# Altium schematic sheet Power.SchDoc
size B; SheetNumber: 1; SheetTotal: 4
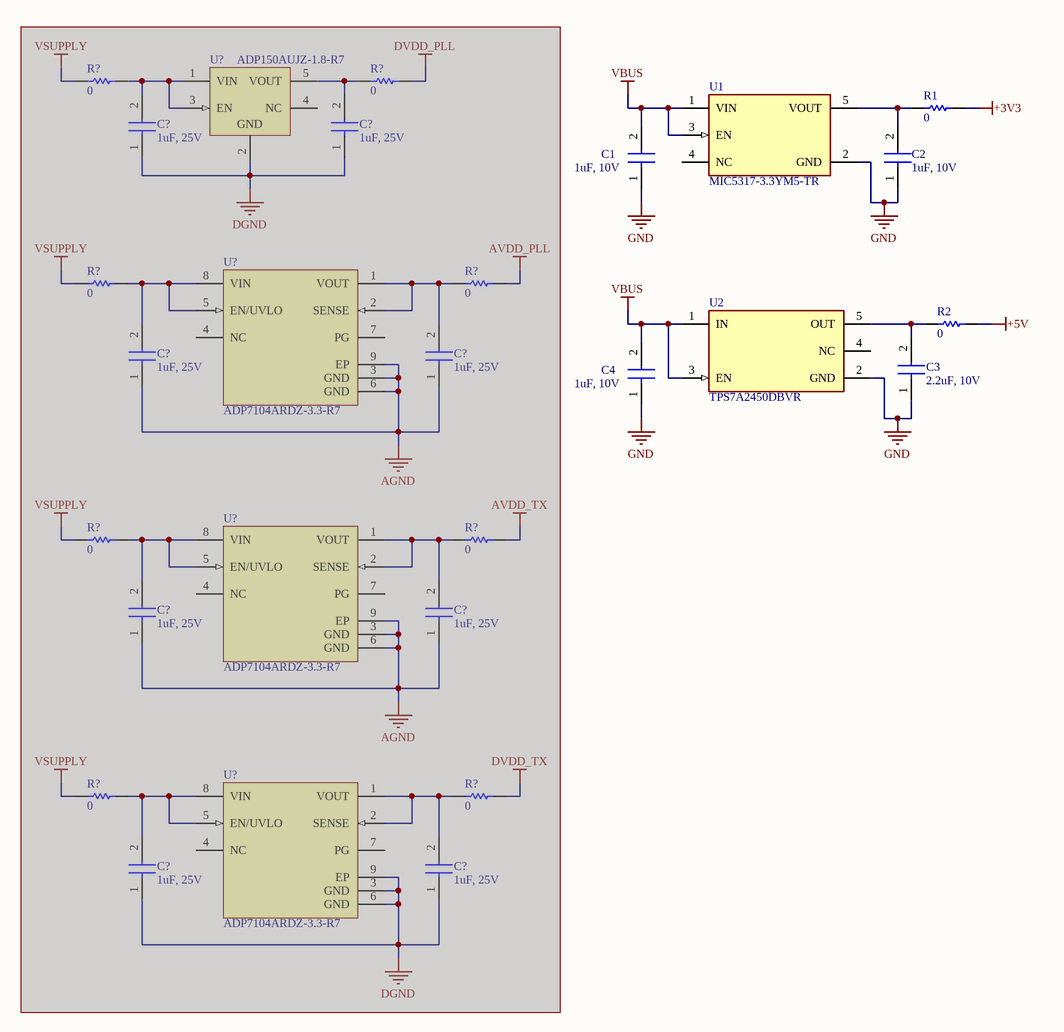
[diagram p0: Power.SchDoc]

## Parts
(Parts that share a designator on the sheet are numbered #1, #2 ... from top to bottom, then left to right.)
C1  1uF, 10V  [FP-CL10-IPC_A]
C2  1uF, 10V  [FP-CL10-IPC_A]
C3  2.2uF, 10V  [FP-CL10-IPC_A]
C4  1uF, 10V  [FP-CL10-IPC_A]
C?#1  1uF, 25V  [CAP_CL21B105KAFNNNE_SAM]  (masked out: inside a compile mask, not in the netlist)
C?#2  1uF, 25V  [CAP_CL21B105KAFNNNE_SAM]  (masked out: inside a compile mask, not in the netlist)
C?#3  1uF, 25V  [CAP_CL21B105KAFNNNE_SAM]  (masked out: inside a compile mask, not in the netlist)
C?#4  1uF, 25V  [CAP_CL21B105KAFNNNE_SAM]  (masked out: inside a compile mask, not in the netlist)
C?#5  1uF, 25V  [CAP_CL21B105KAFNNNE_SAM]  (masked out: inside a compile mask, not in the netlist)
C?#6  1uF, 25V  [CAP_CL21B105KAFNNNE_SAM]  (masked out: inside a compile mask, not in the netlist)
C?#7  1uF, 25V  [CAP_CL21B105KAFNNNE_SAM]  (masked out: inside a compile mask, not in the netlist)
C?#8  1uF, 25V  [CAP_CL21B105KAFNNNE_SAM]  (masked out: inside a compile mask, not in the netlist)
R1  0  [RESC1005X40X25ML05T05]
R2  0  [RESC1005X40X25ML05T05]
R?#1  0  [RES_ERJ-6GEY0R00V]  (masked out: inside a compile mask, not in the netlist)
R?#2  0  [RES_ERJ-6GEY0R00V]  (masked out: inside a compile mask, not in the netlist)
R?#3  0  [RES_ERJ-6GEY0R00V]  (masked out: inside a compile mask, not in the netlist)
R?#4  0  [RES_ERJ-6GEY0R00V]  (masked out: inside a compile mask, not in the netlist)
R?#5  0  [RES_ERJ-6GEY0R00V]  (masked out: inside a compile mask, not in the netlist)
R?#6  0  [RES_ERJ-6GEY0R00V]  (masked out: inside a compile mask, not in the netlist)
R?#7  0  [RES_ERJ-6GEY0R00V]  (masked out: inside a compile mask, not in the netlist)
R?#8  0  [RES_ERJ-6GEY0R00V]  (masked out: inside a compile mask, not in the netlist)
U1  MIC5317-3.3YM5-TR  [FP-SOT23-5LD-PL-1-IPC_C]
U2  TPS7A2450DBVR  [FP-DBV0005A-IPC_C]
U?#1  ADP150AUJZ-1.8-R7  (masked out: inside a compile mask, not in the netlist)
U?#2  ADP7104ARDZ-3.3-R7  [ADI-RD-8-2_M]  (masked out: inside a compile mask, not in the netlist)
U?#3  ADP7104ARDZ-3.3-R7  [ADI-RD-8-2_M]  (masked out: inside a compile mask, not in the netlist)
U?#4  ADP7104ARDZ-3.3-R7  [ADI-RD-8-2_M]  (masked out: inside a compile mask, not in the netlist)

## Nets
+3V3: R1.2
+5V: R2.2
GND: C1.1 C2.1 C3.1 C4.1 U1.2(GND) U2.2(GND)
VBUS: C1.2 C4.2 U1.1(VIN) U1.3(EN) U2.1(IN) U2.3(EN)
NetC2_2: C2.2 R1.1 U1.5(VOUT)
NetC3_2: C3.2 R2.1 U2.5(OUT)

Not connected (* = marked no-connect by the designer): U1 4(NC); U2 4(NC)

## Library data of the parts
C1 C2 C4 = CL10B105KP8NNNC: Ceramic Capacitor, Multilayer, Ceramic, 10V, 10% +Tol, 10% -Tol, X7R, 15% TC, 1uF, Surface Mount, 0603; Manufacturer: Samsung; Multilayer: Yes; Supplier: Digikey; Supplier Part Number: 1276-1946-6-ND; Manufacturer Part Number: CL10B105KP8NNNC; RoHS: Yes; Category: Ceramic Capacitors; Stock: 5561968; Pricing: 1=0.08, 10=0.006, 100=0.0056, 1000=0.00528 (USD); Mounting Technology: Surface Mount; Pins: 2; Dielectric Material: Ceramic; Package Shape: Rectangular; Case/Package: 0603; Terminal Finish: Nickel; Min Operating Temperature: -55°C; Max Operating Temperature: 125°C; JESD-609 Code: e3; Value: 1uF; Capacitor Type: Ceramic; Tolerance  (fill in as +-): 10%; Package Style: SMTMeter; Packaging: Tape and Reel; Tolerance (fill in as +-): 10%; Rated DC Voltage (URdc): 10V; Temperature Characteristics Code: X7R; Termination: Wraparound; Length: 1.6mm; Width: 0.8mm; Height: 0.9mm; Reach SVHC Compliant: Yes; RoHS Compliant: Yes; ComponentLink1URL: https://datasheet.ciiva.com:443/pdfs/VipMasterIC/IC/SEMS/SEMS-S-A0008526420/SEMS-S-A0008526450-1.pdf?src-supplier=IHS+Markit; ComponentLink1Description: https://datasheet.ciiva.com:443/pdfs/VipMasterIC/IC/SEMS/SEMS-S-A0008526420/SEMS-S-A0008526450-1.pdf?src-supplier=IHS+Markit; ComponentLink2URL: https://datasheet.ciiva.com/25788/cl10b105kp8nnnc-25788304.pdf?src-supplier=Digikey; ComponentLink2Description: https://datasheet.ciiva.com/25788/cl10b105kp8nnnc-25788304.pdf?src-supplier=Digikey; ComponentLink3URL: https://datasheet.ciiva.com/26838/getdatasheetpartid-358410-26838426.pdf?src-supplier=Verical; ComponentLink3Description: https://datasheet.ciiva.com/26838/getdatasheetpartid-358410-26838426.pdf?src-supplier=Verical; ComponentLink4URL: https://datasheet.ciiva.com/16396/cl10b105kp8nnnc-16396970.pdf?src-supplier=Future+Electronics; ComponentLink4Description: https://datasheet.ciiva.com/16396/cl10b105kp8nnnc-16396970.pdf?src-supplier=Future+Electronics
C3 = CL10B225KP8NNNC: Ceramic Capacitor, Multilayer, Ceramic, 10V, 10% +Tol, 10% -Tol, X7R, 15% TC, 2.2uF, Surface Mount, 0603; Manufacturer: Samsung; Multilayer: Yes; Supplier: Digikey; Supplier Part Number: 1276-1134-1-ND; Manufacturer Part Number: CL10B225KP8NNNC; RoHS: Yes; Category: Ceramic Capacitors; Stock: 86850; Pricing: 1=0.08, 10=0.017, 100=0.0136, 1000=0.01206 (USD); Mounting Technology: Surface Mount; Pins: 2; Dielectric Material: Ceramic; Package Shape: Rectangular; Case/Package: 0603; Terminal Finish: Nickel; Min Operating Temperature: -55°C; Max Operating Temperature: 125°C; JESD-609 Code: e3; Value: 2.2uF; Capacitor Type: Ceramic; Tolerance  (fill in as +-): 10%; Package Style: SMTMeter; Packaging: Tape and Reel; Tolerance (fill in as +-): 10%; Rated DC Voltage (URdc): 10V; Temperature Characteristics Code: X7R; Termination: Wraparound; Length: 1.6mm; Width: 0.8mm; Height: 0.9mm; Reach SVHC Compliant: Yes; RoHS Compliant: Yes; ComponentLink1URL: https://datasheet.ciiva.com:443/pdfs/VipMasterIC/IC/SEMS/SEMS-S-A0008384515/SEMS-S-A0008873307-1.pdf?src-supplier=IHS+Markit; ComponentLink1Description: https://datasheet.ciiva.com:443/pdfs/VipMasterIC/IC/SEMS/SEMS-S-A0008384515/SEMS-S-A0008873307-1.pdf?src-supplier=IHS+Markit; ComponentLink2URL: https://datasheet.ciiva.com/25798/cl10b225kp8nnnc-25798914.pdf?src-supplier=Digikey; ComponentLink2Description: https://datasheet.ciiva.com/25798/cl10b225kp8nnnc-25798914.pdf?src-supplier=Digikey; ComponentLink3URL: https://datasheet.ciiva.com/15227/getdatasheetpartid-359568-15227195.pdf?src-supplier=Verical; ComponentLink3Description: https://datasheet.ciiva.com/15227/getdatasheetpartid-359568-15227195.pdf?src-supplier=Verical; ComponentLink4URL: https://datasheet.ciiva.com/16500/cl10b225kp8nnnc-16500695.pdf?src-supplier=Future+Electronics; ComponentLink4Description: https://datasheet.ciiva.com/16500/cl10b225kp8nnnc-16500695.pdf?src-supplier=Future+Electronics; ComponentLink5URL: https://datasheet.ciiva.com/29198/457933-da-01-en-vs-kondensator-0603-29198589.pdf?src-supplier=Conrad; ComponentLink5Description: https://datasheet.ciiva.com/29198/457933-da-01-en-vs-kondensator-0603-29198589.pdf?src-supplier=Conrad
C?#1-C?#8 = CL21B105KAFNNNE: Ceramic Capacitor, Multilayer, Ceramic, 25V, 10% +Tol, 10% -Tol, X7R, 15% TC, 1uF, Surface Mount, 0805; Manufacturer: Samsung; Multilayer: Yes; Supplier: Digikey; Supplier Part Number: 1276-1066-1-ND; Manufacturer Part Number: CL21B105KAFNNNE; RoHS: Yes; Category: Ceramic Capacitors; Stock: 34526; Pricing: 1=0.08, 10=0.026, 100=0.0192, 1000=0.0144, 2000=0.00735 (USD); Mounting Technology: Surface Mount; Pins: 2; Dielectric Material: Ceramic; Package Shape: Rectangular; Case/Package: 0805; Terminal Finish: Nickel; Min Operating Temperature: -55°C; Max Operating Temperature: 125°C; JESD-609 Code: e3; Value: 1uF; Capacitor Type: Ceramic; Tolerance  (fill in as +-): 10%; Package Style: SMTMeter; Packaging: Tape and Reel; Tolerance (fill in as +-): 10%; Rated DC Voltage (URdc): 25V; Temperature Characteristics Code: X7R; Termination: Wraparound; Length: 2mm; Width: 1.25mm; Height: 1.35mm; Reach SVHC Compliant: Yes; RoHS Compliant: Yes; ComponentLink1URL: https://datasheet.ciiva.com:443/pdfs/VipMasterIC/IC/SEMS/SEMS-S-A0008523501/SEMS-S-A0008523563-1.pdf?src-supplier=IHS+Markit; ComponentLink1Description: https://datasheet.ciiva.com:443/pdfs/VipMasterIC/IC/SEMS/SEMS-S-A0008523501/SEMS-S-A0008523563-1.pdf?src-supplier=IHS+Markit; ComponentLink2URL: https://datasheet.ciiva.com/25800/cl21b105kafnnne-25800163.pdf?src-supplier=Digikey; ComponentLink2Description: https://datasheet.ciiva.com/25800/cl21b105kafnnne-25800163.pdf?src-supplier=Digikey; ComponentLink3URL: https://datasheet.ciiva.com/15195/getdatasheetpartid-355205-15195880.pdf?src-supplier=Verical; ComponentLink3Description: https://datasheet.ciiva.com/15195/getdatasheetpartid-355205-15195880.pdf?src-supplier=Verical
R1 R2 = ERJ-3GEY0R00V: Fixed Resistor, Metal Glaze/thick Film, 0.1W, 0ohm, Surface Mount, 0603; Manufacturer: Panasonic; Power: 100mW; Rated Temperature: 70°C; Value: 0R; Package Height: 0.45mm; Package Length: 1.6mm; Package Width: 0.8mm; Reference Standard: AEC-Q200; Supplier: Digikey; Supplier Part Number: P0.0GCT-ND; Manufacturer Part Number: ERJ-3GEY0R00V; RoHS: Yes; Category: Chip SMD Resistors; Stock: 690397; Pricing: 1=0.1, 10=0.02, 25=0.0164, 50=0.0144, 100=0.0126, 250=0.0106, 500=0.00936, 1000=0.0083, 5000=0.0064, 10000=0.00578, 15000=0.00546, 25000=0.0051, 35000=0.00489, 50000=0.00468, 125000=0.00421, 250000=0.00392, 500000=0.00367 (USD); Mounting Technology: Surface Mount; Pins: 2; Package Shape: Rectangular; Case/Package: 0603; Terminal Finish: Nickel; Min Operating Temperature: -55°C; Max Operating Temperature: 155°C; JESD-609 Code: e3; Resistor Type: FIXED RESISTOR; Construction: Rectangular; Packaging: Tape and Reel; Technology: METAL GLAZE/THICK FILM; Termination: Wraparound; Reach SVHC Compliant: Yes; RoHS Compliant: Yes; ComponentLink1URL: https://datasheet.ciiva.com:443/pdfs/VipMasterIC/IC/PANA/PANA-S-A0009459603/PANA-S-A0009459603-1.pdf?src-supplier=IHS+Markit; ComponentLink1Description: https://datasheet.ciiva.com:443/pdfs/VipMasterIC/IC/PANA/PANA-S-A0009459603/PANA-S-A0009459603-1.pdf?src-supplier=IHS+Markit; ComponentLink2URL: https://datasheet.ciiva.com/11808/0900766b80f806dd-11808207.pdf?src-supplier=Rs; ComponentLink2Description: https://datasheet.ciiva.com/11808/0900766b80f806dd-11808207.pdf?src-supplier=Rs; ComponentLink3URL: https://datasheet.ciiva.com/27055/1935748-27055113.pdf?src-supplier=Jameco; ComponentLink3Description: https://datasheet.ciiva.com/27055/1935748-27055113.pdf?src-supplier=Jameco; ComponentLink4URL: https://datasheet.ciiva.com/43460/1678796-43460647.pdf?src-supplier=Farnell; ComponentLink4Description: https://datasheet.ciiva.com/43460/1678796-43460647.pdf?src-supplier=Farnell; ComponentLink5URL: https://datasheet.ciiva.com/28695/1678796-28695833.pdf?src-supplier=Element14; ComponentLink5Description: https://datasheet.ciiva.com/28695/1678796-28695833.pdf?src-supplier=Element14; ComponentLink6URL: https://datasheet.ciiva.com/5959/1678796-5959707.pdf?src-supplier=Farnell; ComponentLink6Description: https://datasheet.ciiva.com/5959/1678796-5959707.pdf?src-supplier=Farnell; ComponentLink7URL: https://datasheet.ciiva.com/48532/aoa0000ce1-48532165.pdf?src-supplier=Avnet; ComponentLink7Description: https://datasheet.ciiva.com/48532/aoa0000ce1-48532165.pdf?src-supplier=Avnet; ComponentLink8URL: https://datasheet.ciiva.com/30199/4aoa0000ce1-30199822.pdf?src-supplier=Onlinecomponents.com; ComponentLink8Description: https://datasheet.ciiva.com/30199/4aoa0000ce1-30199822.pdf?src-supplier=Onlinecomponents.com; ComponentLink9URL: https://datasheet.ciiva.com/16834/aoa0000ce1-16834828.pdf?src-supplier=Future+Electronics; ComponentLink9Description: https://datasheet.ciiva.com/16834/aoa0000ce1-16834828.pdf?src-supplier=Future+Electronics; ComponentLink10URL: https://datasheet.ciiva.com/16758/70255313-16758527.pdf?src-supplier=Allied+Electronics; ComponentLink10Description: https://datasheet.ciiva.com/16758/70255313-16758527.pdf?src-supplier=Allied+Electronics; ComponentLink11URL: https://datasheet.ciiva.com/46377/1678796-46377868.pdf?src-supplier=Element14; ComponentLink11Description: https://datasheet.ciiva.com/46377/1678796-46377868.pdf?src-supplier=Element14; ComponentLink12URL: https://datasheet.ciiva.com/9198/aoa0000ce1-9198975.pdf?src-supplier=Avnet; ComponentLink12Description: https://datasheet.ciiva.com/9198/aoa0000ce1-9198975.pdf?src-supplier=Avnet
R?#1-R?#8 = ERJ-6GEY0R00V: Fixed Resistor, Metal Glaze/thick Film, 0.125W, 0ohm, Surface Mount, 0805; Manufacturer: Panasonic; Power: 125mW; Rated Temperature: 70°C; Value: 0R; Package Height: 0.6mm; Package Length: 2mm; Package Width: 1.25mm; Reference Standard: AEC-Q200; Supplier: Digikey; Supplier Part Number: P0.0ACT-ND; Manufacturer Part Number: ERJ-6GEY0R00V; RoHS: Yes; Category: Chip SMD Resistors; Stock: 3178323; Pricing: 1=0.1, 10=0.028, 25=0.0236, 50=0.0204, 100=0.0179, 250=0.01516, 500=0.01342, 1000=0.01193 (USD); Mounting Technology: Surface Mount; Pins: 2; Package Shape: Rectangular; Case/Package: 0805; Terminal Finish: Nickel; Min Operating Temperature: -55°C; Max Operating Temperature: 155°C; JESD-609 Code: e3; Resistor Type: FIXED RESISTOR; Construction: Rectangular; Packaging: Tape and Reel; Technology: METAL GLAZE/THICK FILM; Termination: Wraparound; Reach SVHC Compliant: Yes; RoHS Compliant: Yes; ComponentLink1URL: https://datasheet.ciiva.com:443/pdfs/VipMasterIC/IC/PANA/PANA-S-A0009459603/PANA-S-A0009459603-1.pdf?src-supplier=IHS+Markit; ComponentLink1Description: https://datasheet.ciiva.com:443/pdfs/VipMasterIC/IC/PANA/PANA-S-A0009459603/PANA-S-A0009459603-1.pdf?src-supplier=IHS+Markit; ComponentLink2URL: https://datasheet.ciiva.com/11821/0900766b80f806dd-11821735.pdf?src-supplier=Rs; ComponentLink2Description: https://datasheet.ciiva.com/11821/0900766b80f806dd-11821735.pdf?src-supplier=Rs; ComponentLink3URL: https://datasheet.ciiva.com/28695/1678796-28695877.pdf?src-supplier=Element14; ComponentLink3Description: https://datasheet.ciiva.com/28695/1678796-28695877.pdf?src-supplier=Element14; ComponentLink4URL: https://datasheet.ciiva.com/46377/1678796-46377866.pdf?src-supplier=Element14; ComponentLink4Description: https://datasheet.ciiva.com/46377/1678796-46377866.pdf?src-supplier=Element14; ComponentLink5URL: https://datasheet.ciiva.com/43460/1678796-43460073.pdf?src-supplier=Farnell; ComponentLink5Description: https://datasheet.ciiva.com/43460/1678796-43460073.pdf?src-supplier=Farnell; ComponentLink6URL: https://datasheet.ciiva.com/9117/aoa0000ce1-9117354.pdf?src-supplier=Avnet; ComponentLink6Description: https://datasheet.ciiva.com/9117/aoa0000ce1-9117354.pdf?src-supplier=Avnet
U1 = MIC5317-3.3YM5-TR: Fixed Positive LDO Regulator, 3.3V, 0.31V Dropout, CMOS, PDSO5; Manufacturer: Microchip; Package Body Material: Plastic; Dropout Voltage1-Max: 310mV; Max Supply Voltage: 6V; Min Input Voltage: 4.3V; Channels: 1; Output Current1-Max: 150mA; Output Voltage1-Max: 3.399V; Output Voltage1-Min: 3.201V; Regulator Type: FIXED POSITIVE SINGLE OUTPUT LDO REGULATOR; Supplier: Digikey; Supplier Part Number: MIC5317-3.3YM5-CT-ND; Manufacturer Part Number: MIC5317-3.3YM5-TR; RoHS: No; Category: Voltage Regulators - Linear; Stock: 26650; Pricing: 1=0.22, 25=0.18, 100=0.16, 3000=0.16 (USD); Case/Package: LSSOP; Pins: 5; Package Shape: Rectangular; JESD-30 Code: R-PDSO-G5; Operating Temperature, TJ-Max: 125°C; Operating Temperature, TJ-Min: -40°C; Output Voltage1-Nom: 3.3V; Package Style: SMALL OUTLINE, LOW PROFILE, SHRINK PITCHMeter; Surface Mount: Yes; Technology: CMOS; Terminal Form: Gull Wing; Terminal Position: DUAL; Length: 2.9mm; Width: 1.6mm; Height - Seated (Max): 1.45mm; Terminal Pitch: 0.95mm; Reach SVHC Compliant: Yes; ComponentLink1URL: https://datasheet.ciiva.com:443/pdfs/VipMasterIC/IC/MCRL/MCRLS06213/MCRLS06213-1.pdf?src-supplier=IHS+Markit; ComponentLink1Description: https://datasheet.ciiva.com:443/pdfs/VipMasterIC/IC/MCRL/MCRLS06213/MCRLS06213-1.pdf?src-supplier=IHS+Markit; ComponentLink2URL: http://components.arrow.com/part/dataview/62845788S774067N1374?src-supplier=Arrow+Electronics; ComponentLink2Description: http://components.arrow.com/part/dataview/62845788S774067N1374?src-supplier=Arrow+Electronics; ComponentLink3URL: http://www.microchip.com/mymicrochip/filehandler.aspx?ddocname=en579427&src-supplier=Digikey; ComponentLink3Description: http://www.microchip.com/mymicrochip/filehandler.aspx?ddocname=en579427&src-supplier=Digikey; ComponentLink4URL: https://datasheet.octopart.com/MIC5317-3.3YM5-TR-Microchip-datasheet-26354330.pdf?src-supplier=Element14; ComponentLink4Description: https://datasheet.octopart.com/MIC5317-3.3YM5-TR-Microchip-datasheet-26354330.pdf?src-supplier=Element14
U2 = TPS7A2450DBVR: Fixed Positive LDO Regulator, 5V, 0.25V Dropout, PDSO5; Manufacturer: Texas Instruments; Supplier: Digikey; Supplier Part Number: 296-TPS7A2450DBVRCT-ND; Manufacturer Part Number: TPS7A2450DBVR; RoHS: Yes; Category: Voltage Regulators - Linear; Stock: 4495; Pricing: 1=0.52, 10=0.362, 25=0.324, 100=0.2817, 250=0.26148, 500=0.24932, 1000=0.23931 (USD); ComponentLink1URL: http://www.ti.com/general/docs/suppproductinfo.tsp?distId=10&amp;gotoUrl=http%3A%2F%2Fwww.ti.com%2Flit%2Fgpn%2Ftps7a24&src-supplier=Digikey; ComponentLink1Description: http://www.ti.com/general/docs/suppproductinfo.tsp?distId=10&amp;gotoUrl=http%3A%2F%2Fwww.ti.com%2Flit%2Fgpn%2Ftps7a24&src-supplier=Digikey
U?#1 = ADP150AUJZ-1.8-R7: Fixed Positive LDO Regulator, 1.8V, CMOS, PDSO5; Manufacturer: Analog Devices; Package Body Material: Plastic; Dropout Voltage1-Nom: 105mV; Input Voltage Absolute-Max: 6.5V; Max Supply Voltage: 5.5V; Min Input Voltage: 2.2V; Channels: 1; Output Current1-Max: 150mA; Output Voltage1-Max: 1.827V; Output Voltage1-Min: 1.755V; Package Equivalence Code: TSOP5/6,.11,37; Regulator Type: FIXED POSITIVE SINGLE OUTPUT LDO REGULATOR; Time @ Peak Reflow Temperature-Max (s): 40s; Voltage Tolerance-Max: 2.5%; Qualification Status: Not Qualified; Supplier: Mouser; Supplier Part Number: 584-ADP150AUJZ-1.8R7; Manufacturer Part Number: ADP150AUJZ-1.8-R7; RoHS: Yes; Category: Voltage Regulators - Linear; Stock: 3489; Pricing: 1=1.24, 10=0.902, 50=0.817, 100=0.723, 1000=0.605, 10000=0.559 (USD); Case/Package: VSSOP; Pins: 5; Package Shape: Rectangular; Terminal Finish: Tin; JESD-609 Code: e3; Adjustability: FIXED; JESD-30 Code: R-PDSO-G5; Moisture Sensitivity Level: 1; Number of Outputs: 1; Operating Temperature, TJ-Max: 125°C; Operating Temperature, TJ-Min: -40°C; Output Voltage1-Nom: 1.8V; Packaging: Tape and Reel; Peak Reflow Temperature (Cel): 260°C; Surface Mount: Yes; Technology: CMOS; Terminal Form: Gull Wing; Terminal Position: DUAL; Length: 2.9mm; Width: 1.6mm; Height - Seated (Max): 1mm; Terminal Pitch: 0.95mm; Reach SVHC Compliant: Yes; RoHS Compliant: Yes; ComponentLink1URL: https://datasheet.ciiva.com:443/pdfs/VipMasterIC/IC/ANDI/ANDI-S-A0001491086/ANDI-S-A0001491086-1.pdf?src-supplier=IHS+Markit; ComponentLink1Description: https://datasheet.ciiva.com:443/pdfs/VipMasterIC/IC/ANDI/ANDI-S-A0001491086/ANDI-S-A0001491086-1.pdf?src-supplier=IHS+Markit; ComponentLink2URL: https://datasheet.ciiva.com/2040/adp150-2040604.pdf?src-supplier=Digikey; ComponentLink2Description: https://datasheet.ciiva.com/2040/adp150-2040604.pdf?src-supplier=Digikey; ComponentLink3URL: https://datasheet.ciiva.com/2040/adp150-2040605.pdf?src-supplier=Digikey; ComponentLink3Description: https://datasheet.ciiva.com/2040/adp150-2040605.pdf?src-supplier=Digikey; ComponentLink4URL: https://datasheet.ciiva.com/2040/adp150-2040606.pdf?src-supplier=Digikey; ComponentLink4Description: https://datasheet.ciiva.com/2040/adp150-2040606.pdf?src-supplier=Digikey
U?#2-U?#4 = ADP7104ARDZ-3.3-R7: Fixed Positive LDO Regulator, 3.3V, 0.55V Dropout, CMOS, PDSO8; Manufacturer: Analog Devices; Package Body Material: Plastic; Dropout Voltage1-Nom: 350mV; Channels: 1; Output Current1-Max: 500mA; Output Voltage1-Max: 3.333V; Output Voltage1-Min: 3.234V; Package Equivalence Code: SOP8,.25; Regulator Type: FIXED POSITIVE SINGLE OUTPUT LDO REGULATOR; Dropout Voltage1-Max: 550mV; Input Voltage Absolute-Max: 22V; Max Supply Voltage: 20V; Line Regulation-Max: 0.0078%; Voltage Tolerance-Max: 2%; Qualification Status: Not Qualified; Supplier: Digikey; Supplier Part Number: 505-ADP7104ARDZ-3.3-R7CT-ND; Manufacturer Part Number: ADP7104ARDZ-3.3-R7; RoHS: Yes; Category: Voltage Regulators - Linear; Stock: 2731; Pricing: 1=7, 10=4.65, 25=4.0376, 100=3.3446, 250=3.00444, 500=2.825 (USD); Case/Package: HSOP; Pins: 8; Package Shape: Rectangular; Terminal Finish: Tin; Adjustability: FIXED; JESD-30 Code: R-PDSO-G8; Operating Temperature, TJ-Max: 125°C; Operating Temperature, TJ-Min: -40°C; Package Style: SMALL OUTLINE, HEAT SINK/SLUGMeter; Packaging: Tape and Reel; Surface Mount: Yes; Technology: CMOS; Terminal Form: Gull Wing; Terminal Position: DUAL; Min Input Voltage: 3.3V; Number of Outputs: 1; Output Voltage1-Nom: 3.3V; JESD-609 Code: e3; Moisture Sensitivity Level: 3; Length: 4.9mm; Width: 3.9mm; Height - Seated (Max): 1.75mm; Terminal Pitch: 1.27mm; Reach SVHC Compliant: Yes; RoHS Compliant: Yes; ComponentLink1URL: https://datasheet.ciiva.com:443/pdfs/VipMasterIC/IC/ANDI/ANDI-S-A0008998722/ANDI-S-A0008998722-1.pdf?src-supplier=IHS+Markit; ComponentLink1Description: https://datasheet.ciiva.com:443/pdfs/VipMasterIC/IC/ANDI/ANDI-S-A0008998722/ANDI-S-A0008998722-1.pdf?src-supplier=IHS+Markit; ComponentLink2URL: https://datasheet.ciiva.com/6589/adp7104-6589770.pdf?src-supplier=Digikey; ComponentLink2Description: https://datasheet.ciiva.com/6589/adp7104-6589770.pdf?src-supplier=Digikey; ComponentLink3URL: https://datasheet.ciiva.com/6589/adp7104-6589771.pdf?src-supplier=Digikey; ComponentLink3Description: https://datasheet.ciiva.com/6589/adp7104-6589771.pdf?src-supplier=Digikey; ComponentLink4URL: https://datasheet.ciiva.com/6589/adp7104-6589773.pdf?src-supplier=Digikey; ComponentLink4Description: https://datasheet.ciiva.com/6589/adp7104-6589773.pdf?src-supplier=Digikey; ComponentLink5URL: https://datasheet.ciiva.com/8241/adp7104-8241802.pdf?src-supplier=Avnet; ComponentLink5Description: https://datasheet.ciiva.com/8241/adp7104-8241802.pdf?src-supplier=Avnet